# EAGLE design HandTracker (EAGLE 9.6.2)
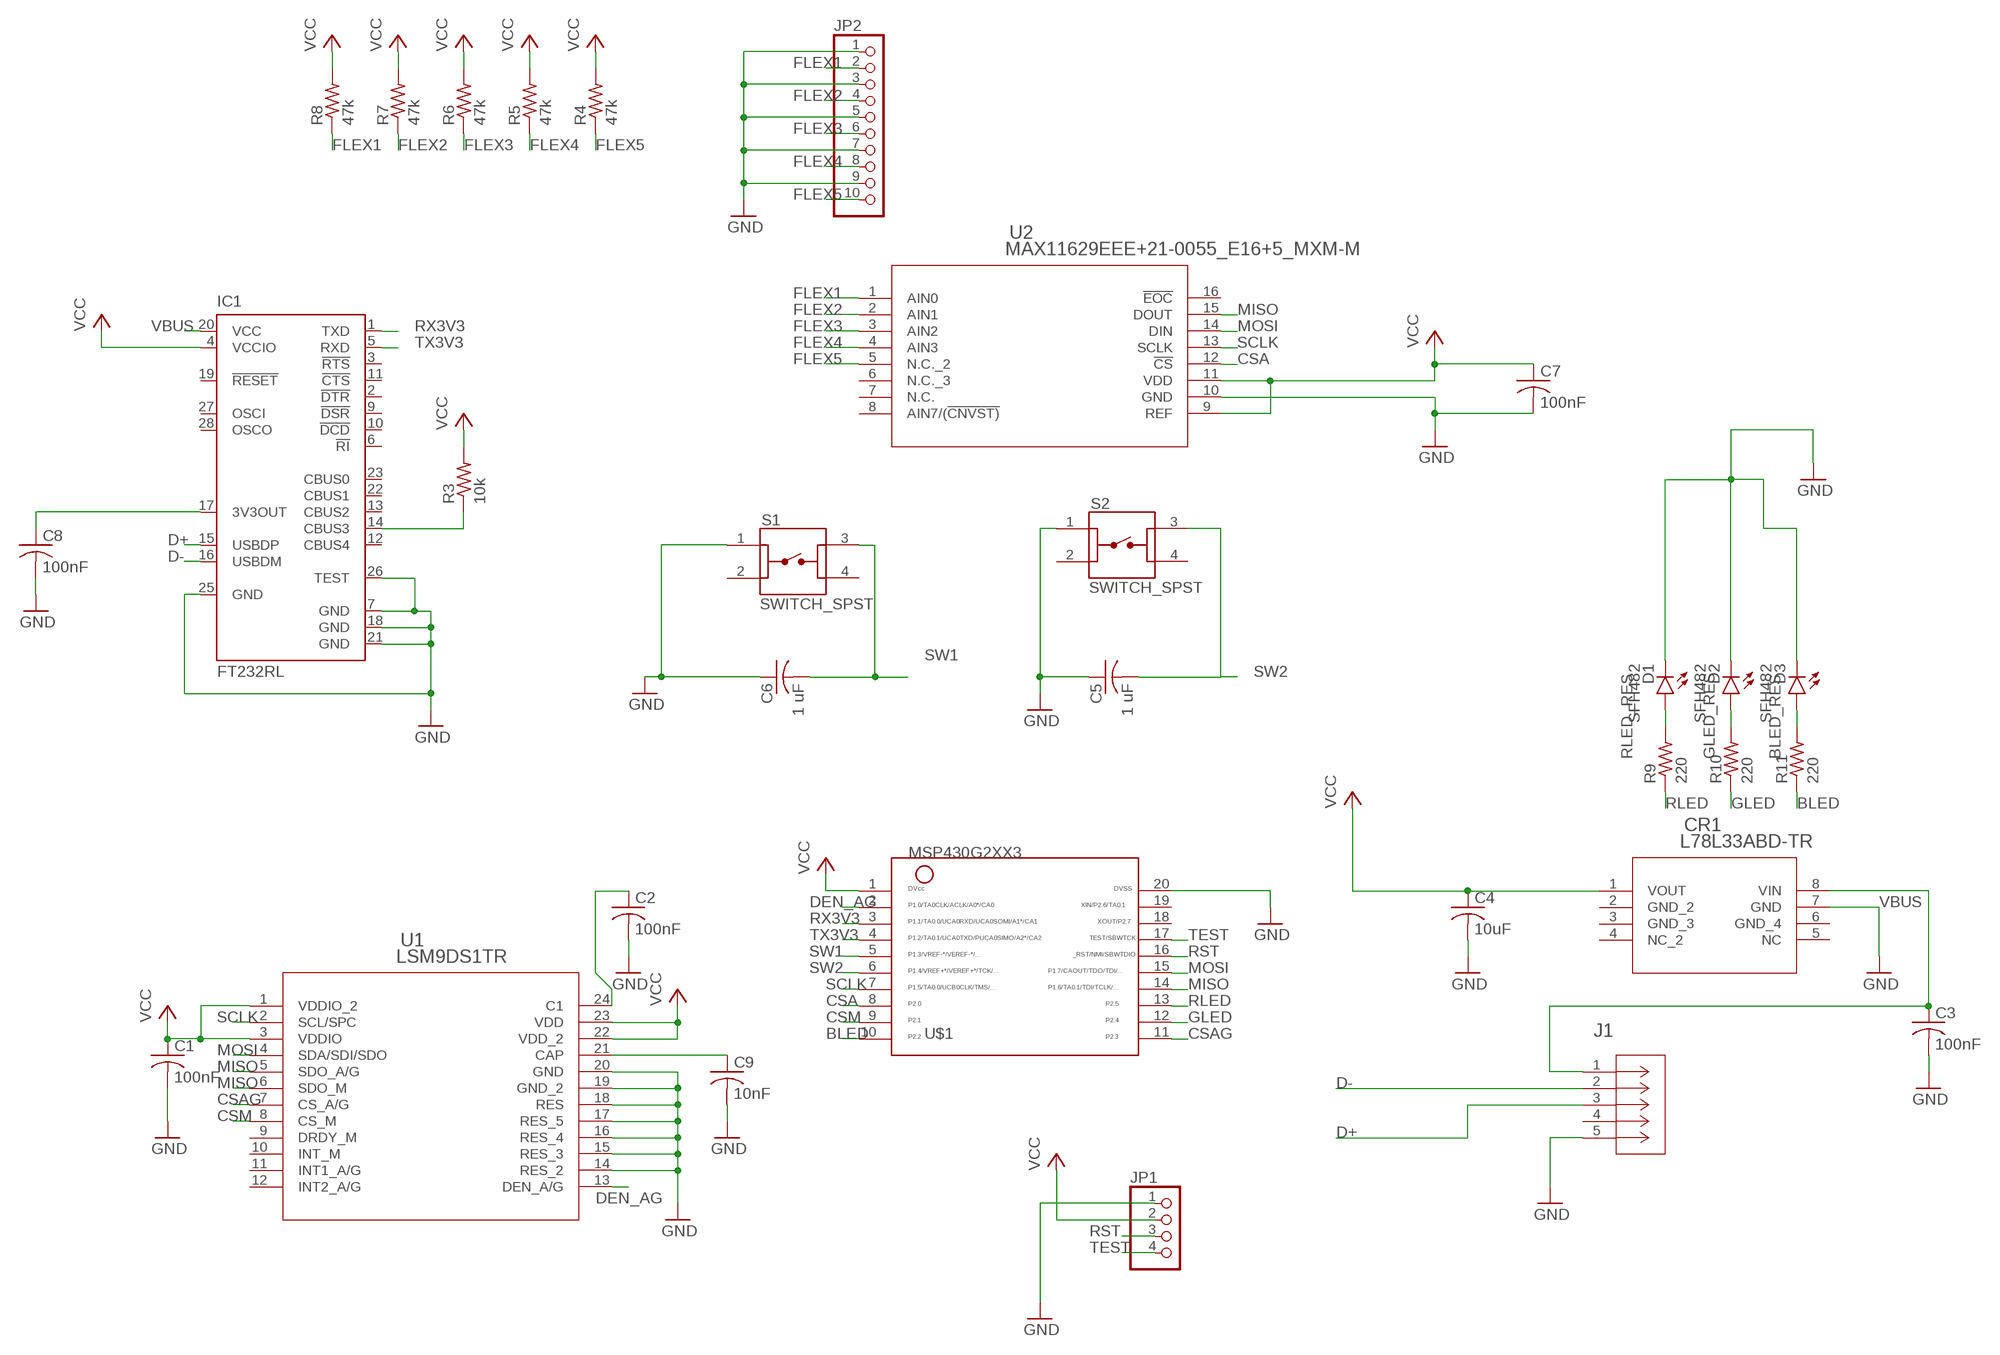
[diagram p0: schematic, sheet 1]

## Parts
C1  100nF  C-USC1206  [C1206]
C2  100nF  C-USC1206  [C1206]
C3  100nF  C-USC1206  [C1206]
C4  10uF  C-USC1206  [C1206]
C5  1 uF  C-USC1206  [C1206]
C6  1 uF  C-USC1206  [C1206]
C7  100nF  C-USC1206  [C1206]
C8  100nF  C-USC1206  [C1206]
C9  10nF  C-USC1206  [C1206]
CR1  L78L33ABD-TR  [SO-8_STM]
D1  SFH482  [SFH482]
D2  SFH482  [SFH482]
D3  SFH482  [SFH482]
IC1  FT232RL  [SSOP28]
J1  ZX62-AB-5PA(31)  [CONN5_ZX62-AB-5PA_HIR]
JP1  PINHD-1X4/90  [1X04/90]
JP2  PINHD-1X10  [1X10]
R3  10k  R-US_R1206  [R1206]
R4  47k  R-US_R1206  [R1206]
R5  47k  R-US_R1206  [R1206]
R6  47k  R-US_R1206  [R1206]
R7  47k  R-US_R1206  [R1206]
R8  47k  R-US_R1206  [R1206]
R9  220  R-US_R1206  [R1206]
R10  220  R-US_R1206  [R1206]
R11  220  R-US_R1206  [R1206]
S1  SWITCH_SPST  [SW_1825910-7]
S2  SWITCH_SPST  [SW_1825910-7]
U1  LSM9DS1TR  [LGA-24_3X3P5X1_STM]
U2  MAX11629EEE+21-0055_E16+5_MXM-M  [21-0055_E16+5_MXM-M]
U$1  MSP430G2XX3TSSOP  [PW20]

## Nets
BLED: R11.1 U$1.10
BLED_RES: D3.A R11.2
CSA: U2.12(!CS) U$1.8
CSAG: U1.7(CS_A/G) U$1.11
CSM: U1.8(CS_M) U$1.9
D+: IC1.15(USBDP) J1.3(D+)
D-: IC1.16(USBDM) J1.2(D-)
DEN_AG: U1.13(DEN_A/G) U$1.2
FLEX1: JP2.2 R8.1 U2.1(AIN0)
FLEX2: JP2.4 R7.1 U2.2(AIN1)
FLEX3: JP2.6 R6.1 U2.3(AIN2)
FLEX4: JP2.8 R5.1 U2.4(AIN3)
FLEX5: JP2.10 R4.1 U2.5(N.C._2)
GLED: R10.1 U$1.12
GLED_RES: D2.A R10.2
GND: C1.2 C2.2 C3.2 C4.2 C5.1 C6.1 C7.2 C8.2 C9.2 CR1.7(GND) D1.K(C) D2.K(C) D3.K(C) IC1.7(GND) IC1.18(GND) IC1.21(GND) IC1.25(GND) IC1.26(TEST) J1.5(GND) JP1.1 JP2.1 JP2.3 JP2.5 JP2.7 JP2.9 S1.1 S2.1 U1.14(RES_2) U1.15(RES_3) U1.16(RES_4) U1.17(RES_5) U1.18(RES) U1.19(GND_2) U1.20(GND) U2.10(GND) U$1.20
MISO: U1.5(SDO_A/G) U1.6(SDO_M) U2.15(DOUT) U$1.14
MOSI: U1.4(SDA/SDI/SDO) U2.14(DIN) U$1.15
N$1: C2.1 U1.24(C1)
N$3: C8.1 IC1.17(3V3OUT)
N$4: IC1.14(CBUS3) R3.1
N$6: C9.1 U1.21(CAP)
RLED: R9.1 U$1.13
RLED_RES: D1.A R9.2
RST: JP1.3 U$1.16
RX3V3: IC1.1(TXD) U$1.3
SCLK: U1.2(SCL/SPC) U2.13(SCLK) U$1.7
SW1: C6.2 S1.3 U$1.5
SW2: C5.2 S2.3 U$1.6
TEST: JP1.4 U$1.17
TX3V3: IC1.5(RXD) U$1.4
VBUS: C3.1 CR1.8(VIN) IC1.20(VCC) J1.1(VCC)
VCC: C1.1 C4.1 C7.1 CR1.1(VOUT) IC1.4(VCCIO) JP1.2 R3.2 R4.2 R5.2 R6.2 R7.2 R8.2 U1.1(VDDIO_2) U1.3(VDDIO) U1.22(VDD_2) U1.23(VDD) U2.9(REF) U2.11(VDD) U$1.1
Unconnected: CR1.2(GND_2) CR1.3(GND_3) CR1.4(NC_2) CR1.5(NC) CR1.6(GND_4) IC1.2(!DTR) IC1.3(!RTS) IC1.6(!RI) IC1.9(!DSR) IC1.10(!DCD) IC1.11(!CTS) IC1.12(CBUS4) IC1.13(CBUS2) IC1.19(!RESET) IC1.22(CBUS1) IC1.23(CBUS0) IC1.27(OSCI) IC1.28(OSCO) J1.4(ID) S1.2 S1.4 S2.2 S2.4 U1.9(DRDY_M) U1.10(INT_M) U1.11(INT1_A/G) U1.12(INT2_A/G) U2.6(N.C._3) U2.7(N.C.) U2.8(AIN7/(!CNVST)) U2.16(!EOC) U$1.18 U$1.19

## Library data of the parts
C1-C9 = rcl:C-US: CAPACITOR, American symbol; SPICEPREFIX: C
CR1 = Regulator:L78L33ABD-TR; COPYRIGHT: Copyright (C) 2022 Ultra Librarian. All rights reserved.; DIGI-KEY_PART_NUMBER_1: 497-7285-1-ND; DIGI-KEY_PART_NUMBER_2: 497-7285-2-ND; DIGI-KEY_PART_NUMBER_3: 497-7285-6-ND; MANUFACTURER_PART_NUMBER: L78L33ABD-TR; MFR_NAME: STMicroelectronics
D1-D3 = led:SFH482: IR LED infrared emitting diode, Infineon
IC1 = ftdichip:FT232R: Source: http://www.ftdichip.com/Documents/DataSheets/DS_FT232R_v104.pdf; MPN: FT232RL; OC_FARNELL: 1146032; OC_NEWARK: 91K9918
J1 = USBHousing:ZX62-AB-5PA(31); COPYRIGHT: Copyright (C) 2022 Ultra Librarian. All rights reserved.; DIGI-KEY_PART_NUMBER_1: H125279CT-ND; DIGI-KEY_PART_NUMBER_2: H125279DKR-ND; DIGI-KEY_PART_NUMBER_3: H125279TR-ND; MANUFACTURER_PART_NUMBER: ZX62-AB-5PA(31); MFR_NAME: Hirose
JP1 = pinhead:PINHD-1X4: PIN HEADER
JP2 = pinhead:PINHD-1X10: PIN HEADER
R3-R11 = rcl:R-US_: RESISTOR, American symbol; SPICEPREFIX: R
S1 S2 = ELEC327:SWITCH_SPST: TE Connectivity Alcoswitch, 6mm Switch Tactile OFF (ON) SPST Round Button PC Pins 0.05A 24VDC 100000Cycles 2.55N Thru-Hole Loose Through Hole Version 1825910-7 <https://www.digikey.com/en/products/detail/te-connectivity-alcoswitch-switches/1825910-7/1731414> Surface Mount Version 1571563-4 <https://www.digikey.com/en/products/detail/te-connectivity-alcoswitch-switches/1571563-4/2400231>; COMMENT: 1825910-7; CONFIGURATION_POLE-THROW: Single Pole - Single Throw; CONTACT_CURRENT_RATING: 50 mA; DESCRIPTION: Switch Tactile OFF (ON) SPST Round Button PC Pins 0.05A 24VDC 100000Cycle 2.55N Thru-Hole Loose Piece; DIGI-KEY_PART_NUMBER: 450-1804-ND; EU_ROHS_COMPLIANCE: Compliant; MF: TE Connectivity; MP: 1825910-7; PACKAGE: None; PURCHASE-URL: https://pricing.snapeda.com/search/part/1825910-7/?ref=eda
U1 = LSM9DS1:LSM9DS1TR; COPYRIGHT: Copyright (C) 2022 Ultra Librarian. All rights reserved.; DIGI-KEY_PART_NUMBER_1: 497-14946-1-ND; DIGI-KEY_PART_NUMBER_2: 497-14946-2-ND; DIGI-KEY_PART_NUMBER_3: 497-14946-6-ND; DIGI-KEY_PART_NUMBER_4: 497-LSM9DS1TRDKR-NDL; MANUFACTURER_PART_NUMBER: LSM9DS1TR; MFR_NAME: STMicroelectronics
U2 = MAX11629EEE+:MAX11629EEE+; COPYRIGHT: Copyright (C) 2022 Ultra Librarian. All rights reserved.; DIGI-KEY_PART_NUMBER_1: MAX11629EEE+-ND; MANUFACTURER_PART_NUMBER: MAX11629EEE+; MFR_NAME: Maxim Integrated Products
U$1 = ELEC327:MSP430G2XX3: MSP430G2XX3 PDIP (N) 20 Pin Package

## Board
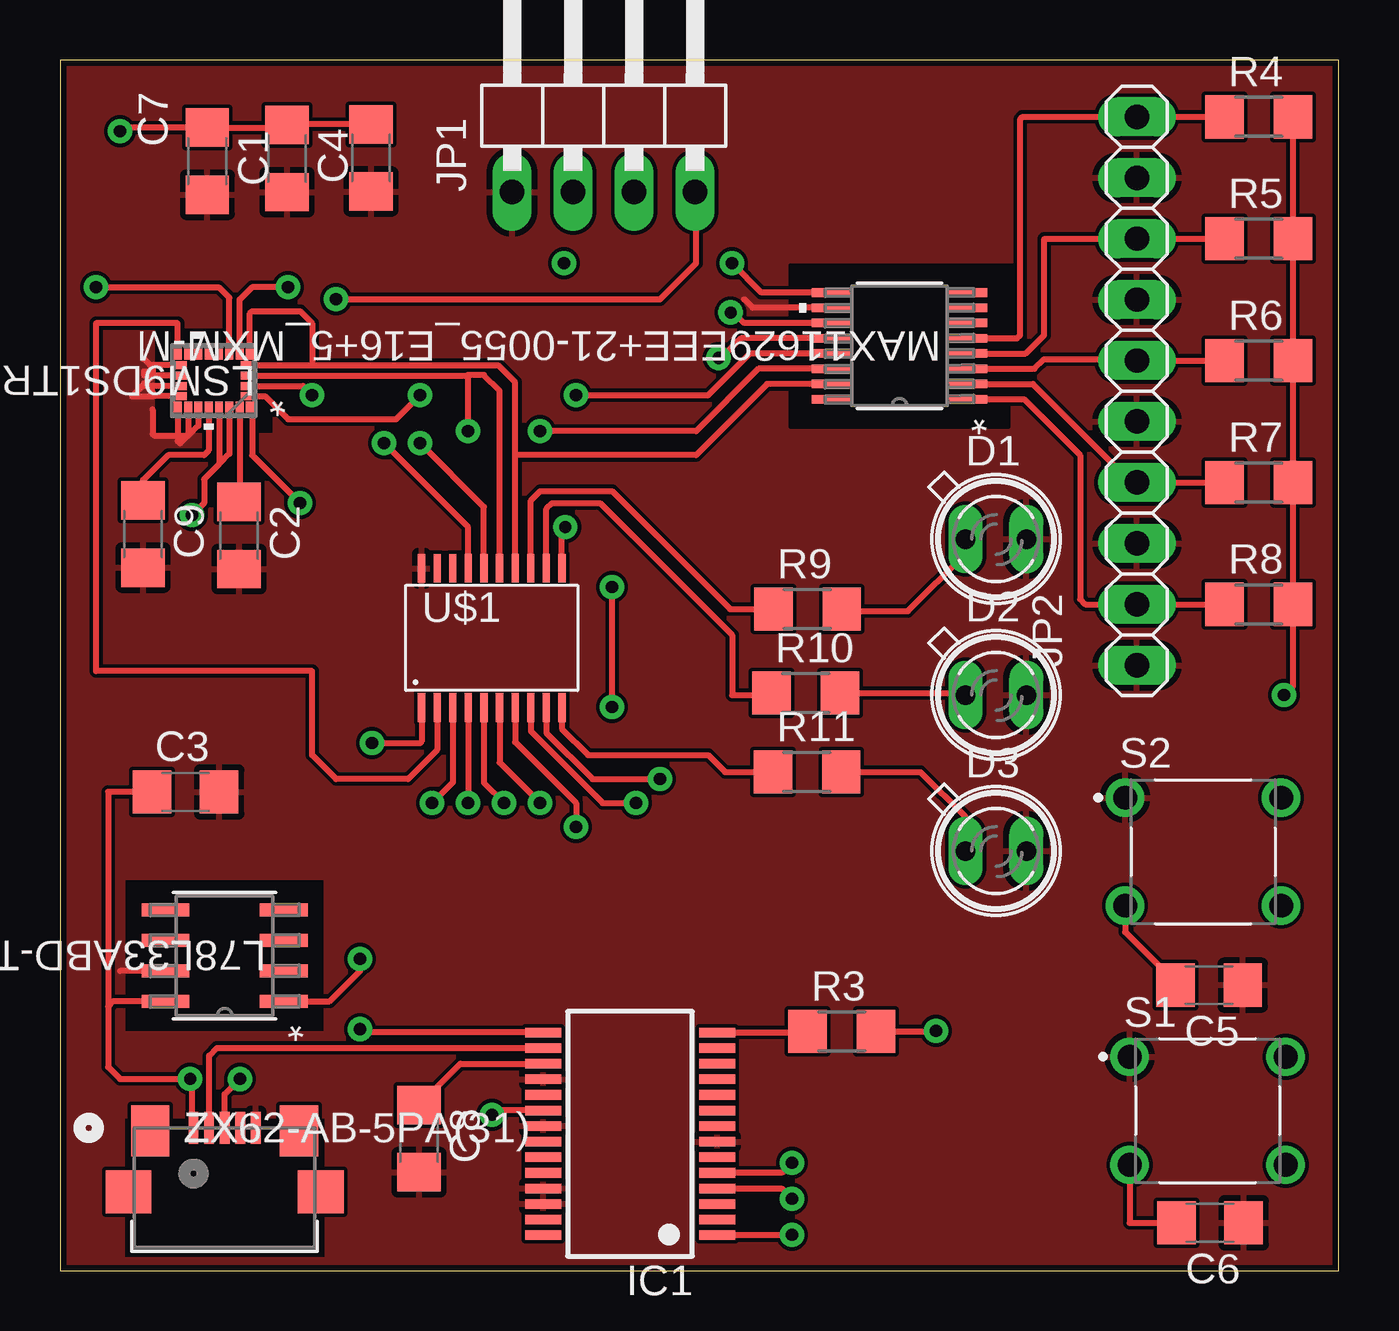
[diagram p1: board, top side]
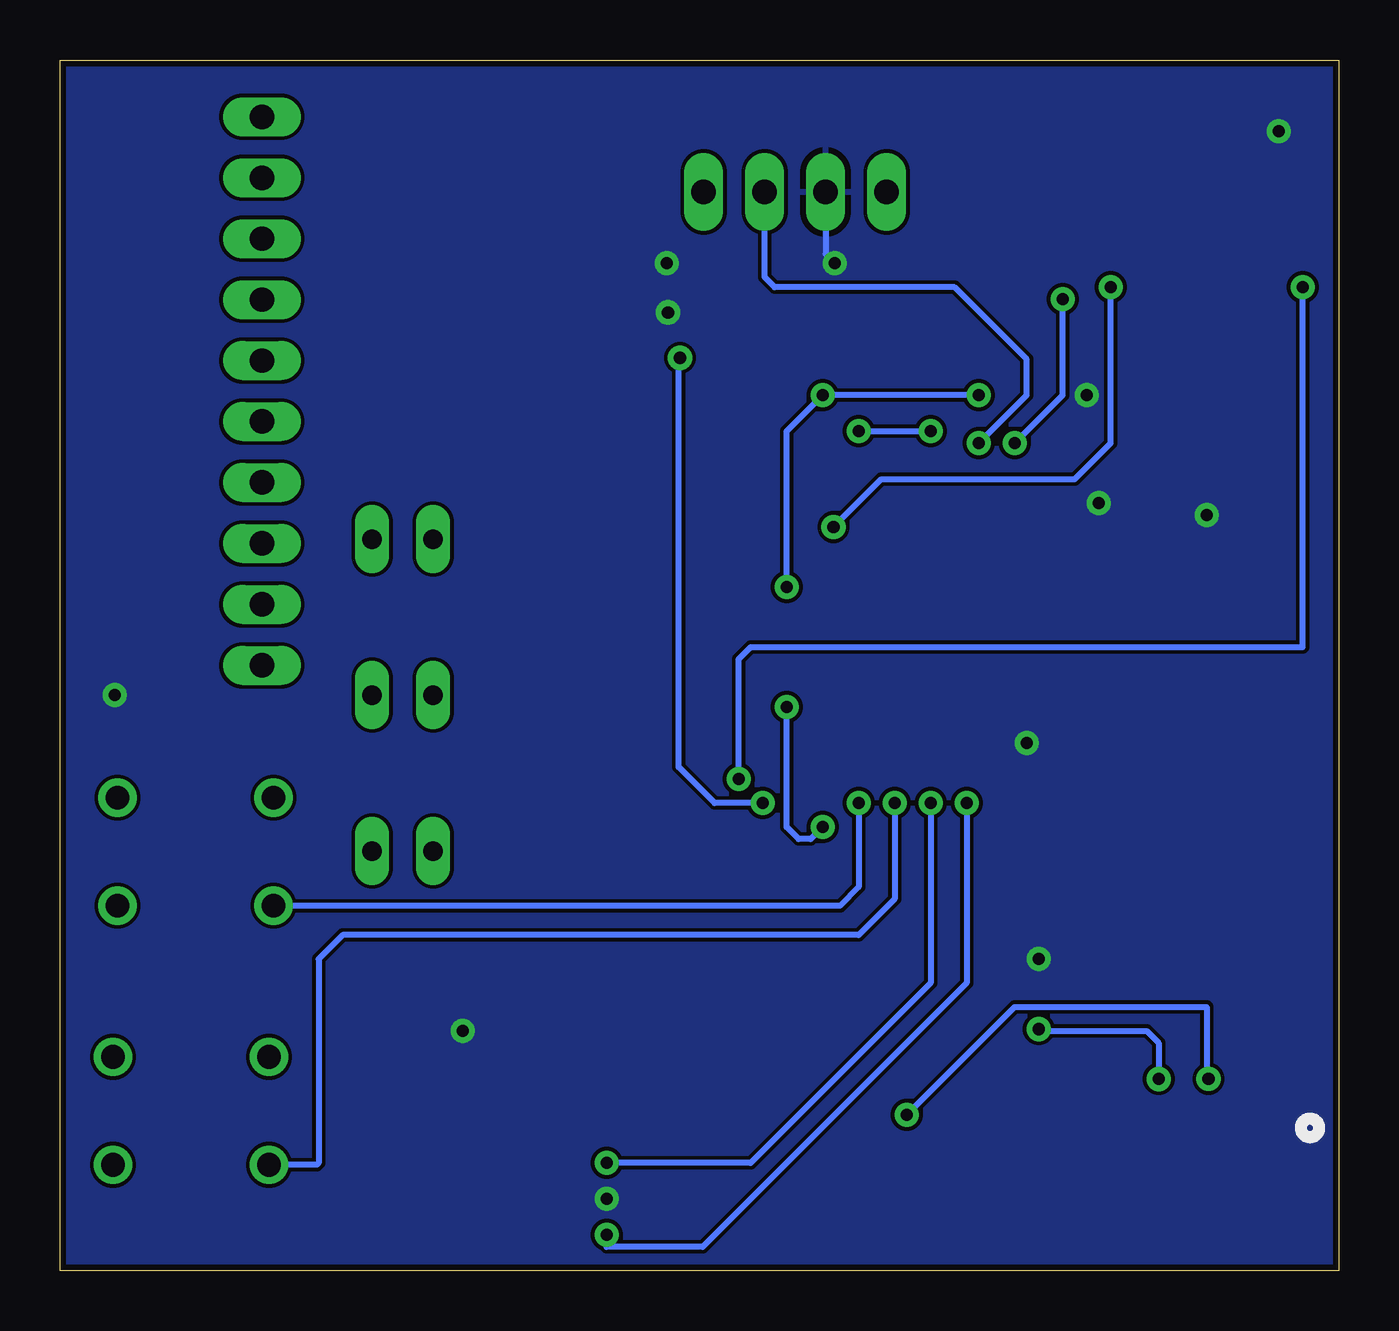
[diagram p2: board, bottom side, seen from below]

Size 53.28 x 50.47 mm. Coordinates in mm from the lower left corner, seen from the top.
Outline: 0,0 53.28,0 53.28,50.47 0,50.47 0,0
Copper layers (1*16): Top 0.035mm / dielectric 1.5mm / Bottom 0.035mm
Design rules "AdvancedCircuitsBarebones": minimum track width 6mil, minimum drill 20mil, track to track 6mil, track to pad 6mil, pad to pad 6mil, via to via 6mil, smd to smd 6mil, copper to edge 10mil, drill to drill 6mil, minimum pad ring 12mil, minimum via ring 10mil, stop-mask expansion 4mil, vias tented up to drill 25mil, thermal gap 10mil

### Footprints (pad centres in the part's own frame; a part is rotated, then mirrored left to right if it is on the bottom)
C1206 = smd 1.6 x 1.8: 1 -1.4,0; 2 1.4,0
SO-8_STM = smd 1.981 x 0.533: 1 -2.464,1.905; 2 -2.464,0.635; 3 -2.464,-0.635; 4 -2.464,-1.905; 5 2.464,-1.905; 6 2.464,-0.635; 7 2.464,0.635; 8 2.464,1.905
SFH482 = drill 0.813 long: A -1.27,0; K 1.27,0
SSOP28 = smd 0.4 x 1.5: 1 -4.225,-3.625; 2 -3.575,-3.625; 3 -2.925,-3.625; 4 -2.275,-3.625; 5 -1.625,-3.625; 6 -0.975,-3.625; 7 -0.325,-3.625; 8 0.325,-3.625; 9 0.975,-3.625; 10 1.625,-3.625; 11 2.275,-3.625; 12 2.925,-3.625; 13 3.575,-3.625; 14 4.225,-3.625; 15 4.225,3.625; 16 3.575,3.625; 17 2.925,3.625; 18 2.275,3.625; 19 1.625,3.625; 20 0.975,3.625; 21 0.325,3.625; 22 -0.325,3.625; 23 -0.975,3.625; 24 -1.625,3.625; 25 -2.275,3.625; 26 -2.925,3.625; 27 -3.575,3.625; 28 -4.225,3.625
CONN5_ZX62-AB-5PA_HIR = smd 0.406 x 1.346: 1 -1.3,2.502; 2 -0.65,2.502; 3 0,2.502; 4 0.65,2.502; 5 1.3,2.502 | smd 1.6 x 2.108: 6 -3.099,2.375; 7 3.099,2.375 | smd 1.905 x 1.803: 8 -4,-0.165; 9 4,-0.165
1X04/90 = drill 1.016 long: 1 -3.81,-3.81; 2 -1.27,-3.81; 3 1.27,-3.81; 4 3.81,-3.81
1X10 = drill 1.016 long: 1 -11.43,0; 2 -8.89,0; 3 -6.35,0; 4 -3.81,0; 5 -1.27,0; 6 1.27,0; 7 3.81,0; 8 6.35,0; 9 8.89,0; 10 11.43,0
R1206 = smd 1.6 x 1.803: 1 -1.422,0; 2 1.422,0
SW_1825910-7 = drill 0.99: 1 -3.25,2.25; 2 3.25,2.25; 3 -3.25,-2.25; 4 3.25,-2.25
LGA-24_3X3P5X1_STM = smd 0.331 x 0.654: 1 -1.505,1.2; 6 -1.505,-1.2; 7 -1.075,-1.2; 8 -0.645,-1.2; 9 -0.215,-1.2; 10 0.215,-1.2; 11 0.645,-1.2; 12 1.075,-1.2; 13 1.505,-1.2; 18 1.505,1.2; 19 1.075,1.2; 20 0.645,1.2; 21 0.215,1.2; 22 -0.215,1.2; 23 -0.645,1.2; 24 -1.075,1.2 | smd 0.654 x 0.331: 2 -1.45,0.645; 3 -1.45,0.215; 4 -1.45,-0.215; 5 -1.45,-0.645; 14 1.45,-0.645; 15 1.45,-0.215; 16 1.45,0.215; 17 1.45,0.645
21-0055_E16+5_MXM-M = smd 1.664 x 0.356: 1 -2.826,2.223; 2 -2.826,1.587; 3 -2.826,0.953; 4 -2.826,0.318; 5 -2.826,-0.318; 6 -2.826,-0.953; 7 -2.826,-1.587; 8 -2.826,-2.223; 9 2.826,-2.223; 10 2.826,-1.587; 11 2.826,-0.953; 12 2.826,-0.318; 13 2.826,0.318; 14 2.826,0.953; 15 2.826,1.587; 16 2.826,2.223
PW20 = smd 0.3 x 1.2: 1 -2.925,-2.9; 2 -2.275,-2.9; 3 -1.625,-2.9; 4 -0.975,-2.9; 5 -0.325,-2.9; 6 0.325,-2.9; 7 0.975,-2.9; 8 1.625,-2.9; 9 2.275,-2.9; 10 2.925,-2.9; 11 2.925,2.9; 12 2.275,2.9; 13 1.625,2.9; 14 0.975,2.9; 15 0.325,2.9; 16 -0.325,2.9; 17 -0.975,2.9; 18 -1.625,2.9; 19 -2.275,2.9; 20 -2.925,2.9

### Placement (x,y rotation side)
C1  6.14,46.25 270 top
C2  7.46,30.65 270 top
C3  5.23,19.96 0 top
C4  9.46,46.36 270 top
C5  47.88,11.91 180 top
C6  47.92,2 180 top
C7  12.96,46.39 270 top
C8  14.96,5.51 270 top
C9  3.46,30.71 270 top
CR1  6.86,13.14 180 top
D1  39,30.5 0 top
D2  39,24 0 top
D3  39,17.5 0 top
IC1  23.75,5.71 90 top
J1  6.86,3.46 0 top
JP1  22.65,48.78 0 top
JP2  44.87,36.67 90 top
R3  32.57,9.98 0 top
R4  49.95,48.1 0 top
R5  49.95,43.02 0 top
R6  49.95,37.94 0 top
R7  49.95,32.86 0 top
R8  49.95,27.78 0 top
R9  31.15,27.58 0 top
R10  31.07,24.08 0 top
R11  31.13,20.79 0 top
S1  47.82,6.67 0 top
S2  47.63,17.47 0 top
U1  6.41,37.1 180 top
U2  34.98,38.55 180 top
U$1  17.99,26.38 0 top

### Tracks (layer width: path | path; a pad name or v marks a point on that pad's centre or on a via)
BLED
  Top 0.254: U$1.10 20.91,22.59 22,21.5 27,21.5 27.71,20.79 R11.1
BLED_RES
  Top 0.254: R11.2 35.85,20.79 37.73,18.91 D3.A
CSA  (via drill 0.51)
  Top 0.254: U$1.8 19.61,22.5 22.61,19.5 v24,19.5 | v27.44,38.06 27.56,38.06 28.37,38.87 U2.12
  Bottom 0.254: v24,19.5 26,19.5 27.5,21 27.5,38 v27.44,38.06
CSAG  (via drill 0.51)
  Top 0.254: U$1.11 20.91,30.91 21,31 v21.05,31 | v9.5,41 8,41 7.49,40.48 U1.7
  Bottom 0.254: v21.05,31 19.05,33 11,33 9.5,34.5 v9.5,41
CSM  (via drill 0.51)
  Top 0.254: U$1.9 20.27,22.42 22.19,20.5 v25,20.5 | v1.5,41 6.61,41 7.05,40.55 U1.8
  Bottom 0.254: v25,20.5 25,25.5 24.5,26 1.5,26 v1.5,41
D+  (via drill 0.51)
  Top 0.254: IC1.15 12.56,9.94 12.5,10 v12.5,10.07 | v7.5,8 6.86,7.36 J1.3
  Bottom 0.254: v12.5,10.07 12.43,10 8,10 7.5,9.5 v7.5,8
D-
  Top 0.254: IC1.16 6.53,9.29 6.21,8.96 J1.2
DEN_AG
  Top 0.254: U$1.2 15.71,21.71 14.5,20.5 11.5,20.5 10.5,21.5 10.5,25 1.5,25 1.5,39.5 4.91,39.5 U1.13
FLEX1
  Top 0.254: R8.1 JP2.2 42.72,27.78 42.5,28 42.5,34 40.17,36.33 U2.1
FLEX2
  Top 0.254: R7.1 JP2.4 44.64,32.86 40.54,36.96 U2.2
FLEX3
  Top 0.254: R6.1 JP2.6 44.81,38 41,38 40.6,37.6 U2.3
FLEX4
  Top 0.254: 48.48,43.02 48.5,43 | U2.4 40.23,38.23 41,39 41,43 41.02,43.02 JP2.8 48.48,43.02 | R5.1 48.48,43.02
FLEX5
  Top 0.254: R4.1 48.46,48.04 48.4,48.1 JP2.10 40.1,48.1 40,48 40,39 39.87,38.87 U2.5
GLED
  Top 0.254: U$1.12 20.27,31.77 20.5,32 22.5,32 28,26.5 28,24 29.57,24 R10.1
GLED_RES
  Top 0.254: 32.57,24 R10.2 37.65,24.08 D2.A
GND
  Top 0.254: U1.14 3.75,37.74 | 3.75,37.74 3.5,38 | 3.75,37.74 3.86,37.64 3.86,37.31 | 3.86,37.31 3.5,37.31 3.5,37.5 3.67,37.5 3.86,37.31 | 3.86,37.31 3.54,37 3.5,37 3.86,36.64 3.86,36.45 | 3.86,36.45 3,36.45 3.43,36.88 U1.16 | U1.15 3.86,37.31 | CR1.7 2.5,12.5 | U1.17 3.86,36.45 | U1.18 4.91,34.59 5,34.5 5.3,34.8 | 3.86,35.9 3.86,34.88 3.94,34.8 5.33,34.8 | U1.19 5.33,34.8 | U1.20 5.76,35.23 5.33,34.8 | U2.10 28.86,40.14 28.5,40.5
  pour Top: 0,0 0,50.5 53.5,50.5 53.5,0
MISO
  Top 0.254: U$1.14 18.96,34 | 18.96,34 18.96,37.03 18.25,37.74 10.5,37.74 | 18.96,34 26.5,34 29.46,36.96 U2.15 | U1.6 7.92,39.91 8,40 10,40 10.5,39.5 10.5,37.74 | U1.5 10.5,37.74
MOSI  (via drill 0.51)
  Top 0.254: U$1.15 18.32,36.69 17.66,37.34 17,37.34 | v20,35 26.5,35 29.1,37.6 U2.14 | v17,35 17,37.34 | U1.4 16.98,37.31 17,37.34
  Bottom 0.254: v20,35 v17,35
N$1
  Top 0.254: U1.24 7.49,32.08 C2.1
N$3
  Top 0.254: C8.1 16.68,8.63 IC1.17
N$4
  Top 0.254: IC1.14 31.1,9.94 R3.1
N$6
  Top 0.254: C9.1 3.46,32.96 4.5,34 6,34 6.2,34.2 U1.21
RLED
  Top 0.254: U$1.13 19.61,32.12 20,32.5 23,32.5 27.92,27.58 R9.1
RLED_RES
  Top 0.254: R9.2 32.65,27.5 35.33,27.5 37.73,29.9 D1.A
RST  (via drill 0.51)
  Top 0.254: U$1.16 17.66,31.84 v15,34.5
  Bottom 0.254: v15,34.5 13,36.5 13,38 16,41 23.5,41 23.92,41.42 JP1.3
RX3V3  (via drill 0.51)
  Top 0.254: U$1.3 16.36,20.36 v15.5,19.5 | v30.5,1.5 30.48,1.49 IC1.1
  Bottom 0.254: v15.5,19.5 15.5,12 26.5,1 30.5,1 v30.5,1.5
SCLK  (via drill 0.51)
  Top 0.254: U$1.7 18.96,22.04 21.5,19.5 v21.5,18.5 | v21.5,36.5 27,36.5 28.73,38.23 U2.13 | v23,23.5 v23,28.5 | U1.2 8.54,36.45 9.5,35.5 14,35.5 v15,36.5
  Bottom 0.254: v15,36.5 v21.5,36.5 23,35 v23,28.5 | v21.5,18.5 22,18 22.5,18 23,18.5 v23,23.5
SW1  (via drill 0.51)
  Top 0.254: S1.3 44.57,2 C6.2 | U$1.5 17.66,20.34 v18.5,19.5
  Bottom 0.254: v18.5,19.5 18.5,15.5 20,14 41.5,14 42.5,13 42.5,4.5 42.58,4.42 S1.3
SW2  (via drill 0.51)
  Top 0.254: S2.3 44.38,14.12 46.48,12.02 C5.2 | U$1.6 18.32,21.18 v20,19.5
  Bottom 0.254: v20,19.5 20,16 20.78,15.22 S2.3
TEST  (via drill 0.51)
  Top 0.254: U$1.17 17,29.3 17,31 v13.5,34.5 | v11.5,40.5 25,40.5 26.5,42 26.5,44.93 JP1.4
  Bottom 0.254: v13.5,34.5 11.5,36.5 v11.5,40.5
TX3V3  (via drill 0.51)
  Top 0.254: U$1.4 17.02,19.52 v17,19.5 | v30.5,4.5 30.09,4.08 IC1.5
  Bottom 0.254: v17,19.5 17,12 24.5,4.5 v30.5,4.5
VBUS  (via drill 0.51)
  Top 0.254: 2,11.01 2.22,11.23 CR1.8 | 2,11.01 2,8.5 2.5,8 v5.42,8 5.5,8 5.5,6.02 J1.1 | IC1.20 18.18,6.68 v18,6.5 | C3.1 2,19.96 2,11.01
  Bottom 0.254: v18,6.5 13.5,11 5.5,11 5.5,8 v5.42,8
VCC  (via drill 0.51)
  Top 0.254: 27.44,3.5 IC1.4 30.07,3.44 v30.5,3 | U$1.1 15.06,22.07 15,22 v13,22 | C7.1 9.49,47.79 C4.1 9.35,47.65 C1.1 2.65,47.65 v2.5,47.5 | R4.2 R5.2 R6.2 R7.2 R8.2 51.37,24.37 v51,24 | R3.2 36.48,9.98 v36.5,10 | U1.1 8,35.81 8,34 v10,32 | CR1.1 11.23,11.23 12.5,12.5 v12.5,13 | U1.22 6.62,33.62 | 6.62,33.62 6,33 6,32 v5.5,31.5 | U1.23 7.05,34.05 6.62,33.62 | U1.3 10.12,36.88 v10.5,36.5 | U2.9 29.23,40.77 v28,42 | U2.11 28.5,39.5 28,40 v27.94,39.94
  Bottom 0.254: JP1.2 21.38,42.38 v21,42
  pour Bottom: 0,50.5 53.5,50.5 53.5,0 0,0